# Altium schematic sheet clock.SchDoc
size A4; SheetNumber: 4; SheetTotal: 6
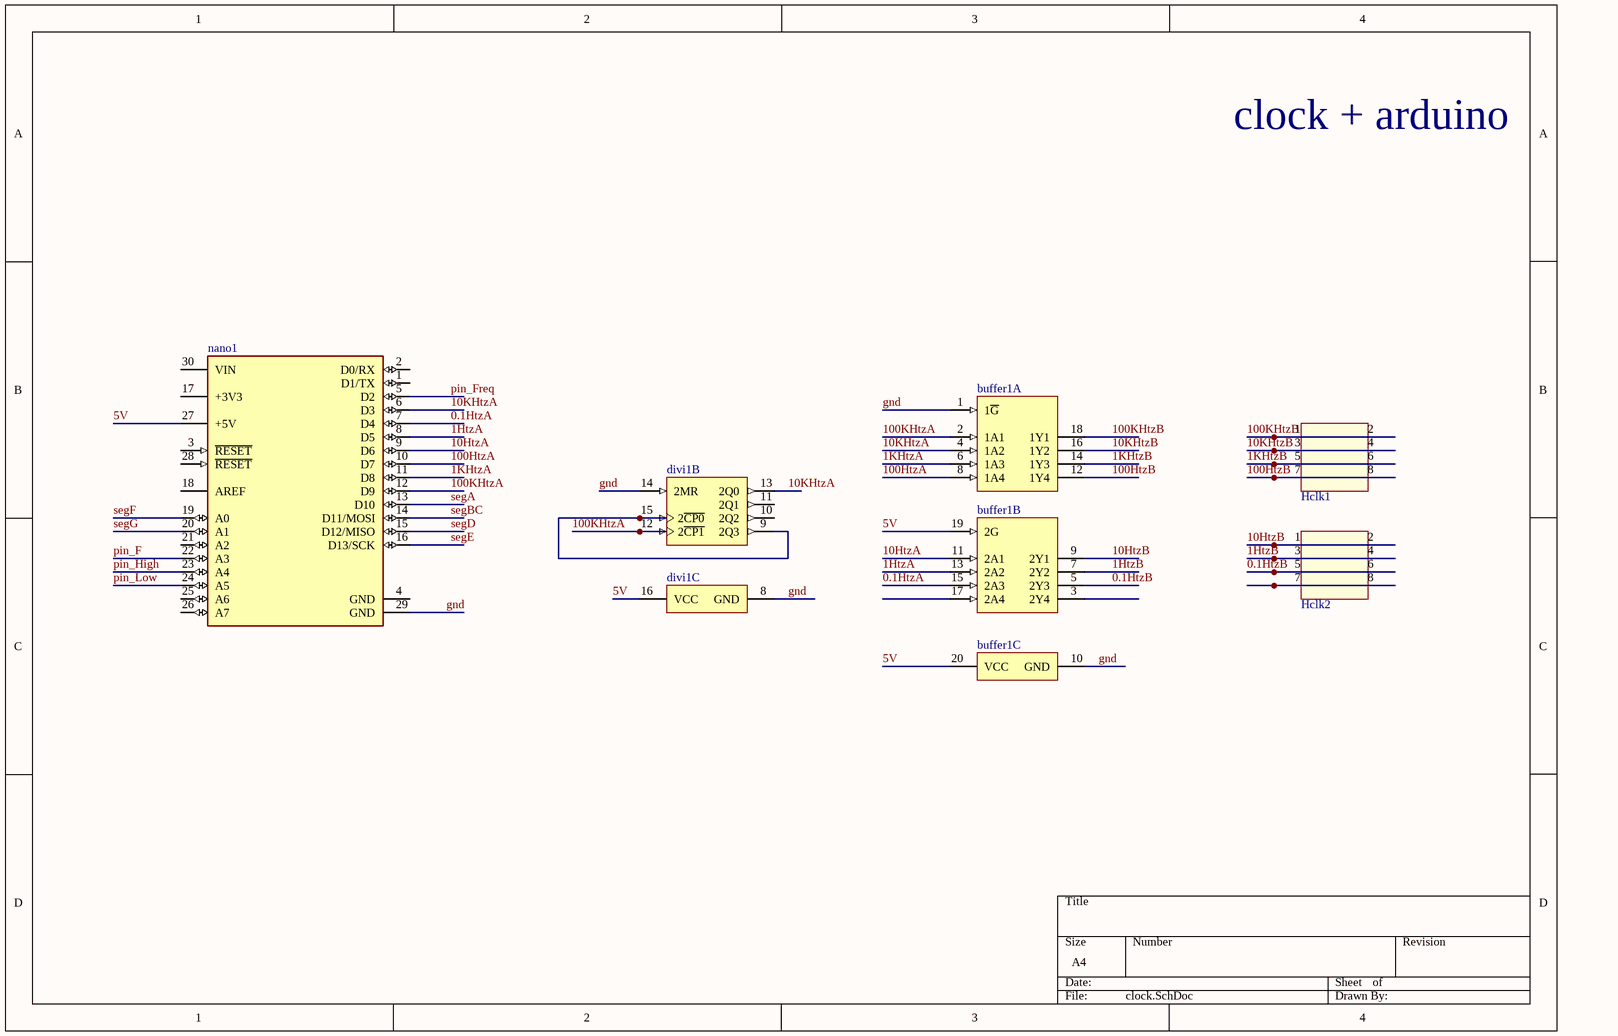
[diagram p0: clock.SchDoc]

## Parts
buffer1  SN74LS241N  [N0020A]  (value not drawn)  (parts A,B,C of 3)
divi1  CD74HC390E  [N0016A]  (value not drawn)  (parts B,C of 3)
Hclk1  header 2x4  [header 2x4]  (value not drawn)
Hclk2  header 2x4  [header 2x4]  (value not drawn)
nano1  A000005  [FP-A000005-MFG]  (value not drawn)

## Nets
0.1HtzA: buffer1.15(2A3) nano1.7(D4)
0.1HtzB: buffer1.5(2Y3) Hclk2.5 Hclk2.6
1HtzA: buffer1.13(2A2) nano1.8(D5)
1HtzB: buffer1.7(2Y2) Hclk2.3 Hclk2.4
1KHtzA: buffer1.6(1A3) nano1.11(D8)
1KHtzB: buffer1.14(1Y3) Hclk1.5 Hclk1.6
5V: buffer1.19(2G) buffer1.20(VCC) divi1.16(VCC) nano1.27(+5V)
10HtzA: buffer1.11(2A1) nano1.9(D6)
10HtzB: buffer1.9(2Y1) Hclk2.1 Hclk2.2
10KHtzA: buffer1.4(1A2) divi1.13(2Q0) nano1.6(D3)
10KHtzB: buffer1.16(1Y2) Hclk1.3 Hclk1.4
100HtzA: buffer1.8(1A4) nano1.10(D7)
100HtzB: buffer1.12(1Y4) Hclk1.7 Hclk1.8
100KHtzA: buffer1.2(1A1) divi1.12(2~{CP1}) nano1.12(D9)
100KHtzB: buffer1.18(1Y1) Hclk1.1 Hclk1.2
gnd: buffer1.1(1~{G}) buffer1.10(GND) divi1.8(GND) divi1.14(2MR) nano1.29(GND)
pin_F: nano1.22(A3)
pin_Freq: nano1.5(D2)
pin_High: nano1.23(A4)
pin_Low: nano1.24(A5)
segA: nano1.13(D10)
segBC: nano1.14(D11/MOSI)
segD: nano1.15(D12/MISO)
segE: nano1.16(D13/SCK)
segF: nano1.19(A0)
segG: nano1.20(A1)
Netdivi1_9: divi1.9(2Q3) divi1.15(2~{CP0})
NetHclk2_7: Hclk2.7 Hclk2.8

Not connected (* = marked no-connect by the designer): buffer1 3(2Y4) 17(2A4); divi1 10(2Q2) 11(2Q1); nano1 1(D1/TX) 2(D0/RX) 3(~{RESET}) 4(GND) 17(+3V3) 18(AREF) 21(A2) 25(A6) 26(A7) 28(~{RESET}) 30(VIN)

## Notes on the sheet
- clock + arduino

## Library data of the parts
buffer1 = CMP-0440-00144-3: Octal Buffers And Line Drivers With 3-State Outputs, N0020A, TUBE; Manufacturer: Texas Instruments; Voltage(Nom)(V): 5; Input Type: TTL; F @ Nom Voltage(Max)(Mhz): 35; tpd @ Nom Voltage(Max)(ns): 18; Bits(#): 8; VCC(Min)(V): 4.75; Rating: Catalog; VCC(Max)(V): 5.25; ICC @ Nom Voltage(Max)(mA): 0.046; Generic Part Number: SN74LS241; Code_JEDEC: MS-001; Operating Temperature Range(C): 0 to 70; PackageVersion: http://www.ti.com/lit/ml/mpdi002c/mpdi002c.pdf; PackageReference: N0020A; Output Type: TTL; DatasheetVersion: SDLS144C
divi1 = CMP-1623-00557-2: High Speed CMOS Logic Dual Decade Ripple Counters, N0016A, TUBE; Manufacturer: Texas Instruments; Technology Family: HC; ICC @ Nom Voltage(Max)(mA): 0.08; Inputs: 1; F @ Nom Voltage(Max)(Mhz): 28; tpd @ Nom Voltage(Max)(ns): 52; Bits(#): 4; Input Type: LVTTL/CMOS; Schmitt Trigger: No; Output Drive (IOL/IOH)(Max)(mA): 5.2/-5.2; VCC(Max)(V): 6; Rating: Catalog; VCC(Min)(V): 2; Voltage(Nom)(V): 3.3,5; Output Type: CMOS; Code_JEDEC: MS-001; Generic Part Number: CD74HC390; DatasheetVersion: SCHS185C; Function: Counter; Operating Temperature Range(C): -55 to 125; Type: Decade; PackageReference: N0016A
Hclk1 Hclk2 = header 2x4: header male 2x4; pin to pad: 1>C1 2>C2 3>C3 4>C4 5>C5 6>C6 7>C7 8>C8; Parameter 1: header 2x4
nano1 = CMP-189986-000002-1: ARDUINO NANO ATMEGA328 EVAL BRD; Number of Bits: 8; Evaluation Kit: Yes; Operating Supply Voltage: 12V; Interface: I2C; Data Bus Width: 8b; Core Architecture: AVR; Packaging: Bulk; Length: 7inch; Package Quantity: 50; Width: 5inch; REACH SVHC: No SVHC; Weight: 0.358383oz; Series: AVR® ATmega; Height: 0.25inch